# Altium project UHAL_MCP23017_LOOPBACK_Ver_B.PrjPcb
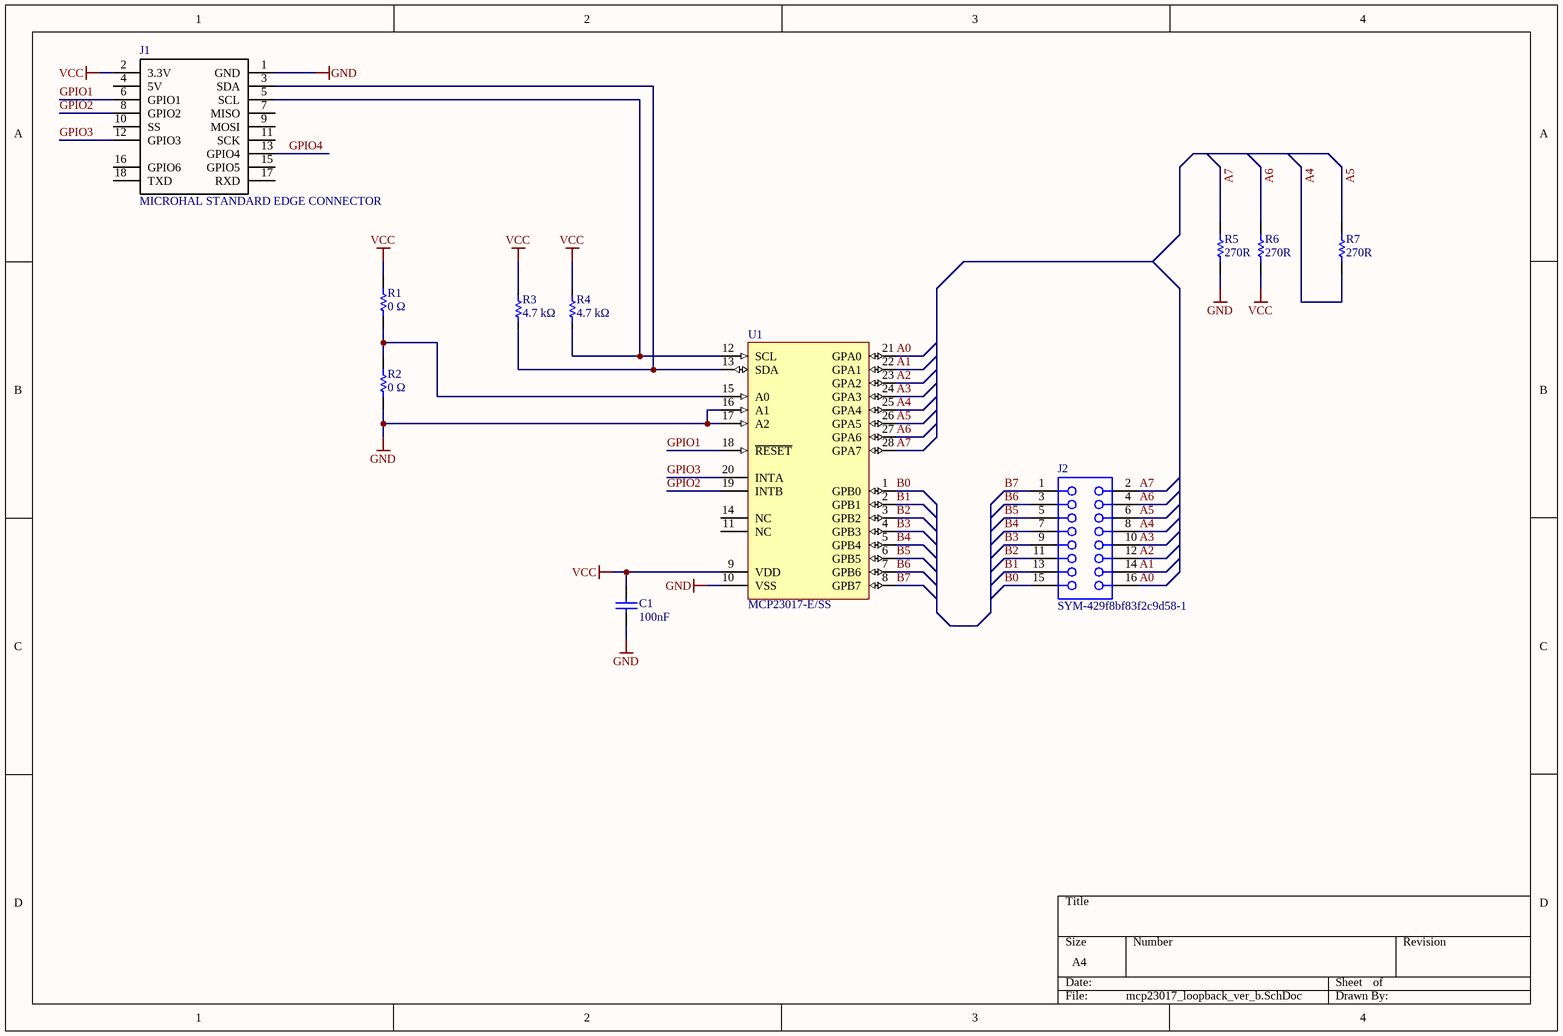
[diagram p0: mcp23017_loopback_ver_b.SchDoc]
1 sheet, 11 parts. Net scope: global (net labels, ports and power ports of the same name join across sheets).

## Sheet mcp23017_loopback_ver_b.SchDoc
size A4

### Parts
C1  Capacitance: 100nF  [CAPC1608X90X35ML10T15]  (hidden comment: Murata GCM188R71H104KA57D)
J1  MICROHAL STANDARD EDGE CONNECTOR  [PCB-n61ghpg3sznbl2uw6fwj-1]
J2  SYM-429f8bf83f2c9d58-1  [HEADER8X2]
R1  0 Ω  [RESC1608X05N]
R2  0 Ω  [RESC1608X05N]
R3  Resistance: 4.7 kΩ  [PCB-cmzy4aezi5zhn2bew7lt-1]  (hidden comment: CRCW06034K70FKEAHP)
R4  Resistance: 4.7 kΩ  [PCB-cmzy4aezi5zhn2bew7lt-1]  (hidden comment: CRCW06034K70FKEAHP)
R5  270R  [RESC1608X05N]
R6  270R  [RESC1608X05N]
R7  270R  [RESC1608X05N]
U1  MCP23017-E/SS  [SSOP-SS28_N]

### Nets
GND: C1.2 J1.1(GND) R2.1 R5.1 U1.10(VSS) U1.16(A1) U1.17(A2)
VCC: C1.1 J1.2(3.3V) R1.2 R3.1 R4.1 R6.1 U1.9(VDD)
A0: J2.16 U1.21(GPA0)
A1: J2.14 U1.22(GPA1)
A2: J2.12 U1.23(GPA2)
A3: J2.10 U1.24(GPA3)
A4: J2.8 R7.2 U1.25(GPA4)
A5: J2.6 R7.1 U1.26(GPA5)
A6: J2.4 R6.2 U1.27(GPA6)
A7: J2.2 R5.2 U1.28(GPA7)
B0: J2.15 U1.1(GPB0)
B1: J2.13 U1.2(GPB1)
B2: J2.11 U1.3(GPB2)
B3: J2.9 U1.4(GPB3)
B4: J2.7 U1.5(GPB4)
B5: J2.5 U1.6(GPB5)
B6: J2.3 U1.7(GPB6)
B7: J2.1 U1.8(GPB7)
GPIO1: J1.6(GPIO1) U1.18(~{RESET})
GPIO2: J1.8(GPIO2) U1.19(INTB)
GPIO3: J1.12(GPIO3) U1.20(INTA)
GPIO4: J1.13(GPIO4)
NetJ1_3: J1.3(SDA) R3.2 U1.13(SDA)
NetJ1_5: J1.5(SCL) R4.2 U1.12(SCL)
NetR1_1: R1.1 R2.2 U1.15(A0)

Not connected (* = marked no-connect by the designer): J1 4(5V) 7(MISO) 9(MOSI) 10(SS) 11(SCK) 15(GPIO5) 16(GPIO6) 17(RXD) 18(TXD); U1 11(NC) 14(NC)

### Library data of the parts
C1 = CMP-119667-3: CAP CER 0.1UF 50V 10% X7R 0603; Lead-Free Status: Lead Free; Voltage Rating (DC): 50.0 V; Capacitance Tolerance: ±10%; Dielectric Characteristic: X7R; Octopart Url: https://octopart.com/gcm188r71h104ka57d-murata-7894792; OctopartID: 3480fdf266eeeb47; Packaging: Cut Tape (CT); REACH SVHC Compliance: No SVHC; RoHS: Compliant
J1 = CMP-6a3uyflm72uf0am1b36s-2: microhal standard edge connector with 17 pins
J2 = CMP-429f8bf83f2c9d58-5: Conn Unshrouded Header HDR 16 POS 2.54mm Solder ST Thru-Hole Poly Bag; Number of Contacts: 16; Octopart URL: http://octopart.com/68602-116hlf-fci-7166165; Pin Pitch: 2.54 mm; Packaging: Bulk; Contact Plating: Gold
R1 R2 R5-R7 = CMP-31acf99032f6ee6b-1: RCA Series 0603 0.1 W 0 O Jumper Surface Mount Thick Film Chip Resistor; Manufacturer Part Number: RCA06030000ZSEA; Lead-Free Status: Lead Free; Power Rating: 100 mW; Case/Package (SI): 1608; RoHS: Compliant; Case/Package: 0603, 1608; OctopartID: 31acf99032f6ee6b; Packaging: Cut Tape (CT); Octopart URL: https://octopart.com/rca06030000zsea-vishay-20325948
R3 R4 = CMP-40e08b60e91c9f27-1: Surface Mount Chip Resistor, Thick Film, AEC-Q200 CRCW Series, 4.7 kohm, 250 mW, 1%, 75 V; Case/Package (SI): 1608; Voltage Rating (DC): 75.0 V; Lead-Free Status: Lead Free; Power Rating: 250 mW; Case/Package: 0603; Number of Pins: 2; REACH SVHC Compliance: No SVHC; OctopartID: 40e08b60e91c9f27; Packaging: Cut Tape (CT); Mounting Style: Surface Mount; Octopart URL: http://octopart.com/crcw06034k70fkeahp-vishay-42634394; Resistance Tolerance: ±1%; Manufacturer Part Number: CRCW06034K70FKEAHP
U1 = CMP-1159044-3: 16-Bit I/O Expander with Serial Interface, 28-Pin SSOP, Extended Temperature; Lead-Free Status: Lead Free; Number of Bits: 16; Supply Current: 0.001 A; Case/Package: SSOP; Lifecycle Status: Active; Mounting Style: Surface Mount; Number of Pins: 28; Octopart Url: https://octopart.com/mcp23017-e%2Fss-microchip-470525; OctopartID: 2f0ee6032795f0c9; Packaging: Tube; REACH SVHC Compliance: No SVHC; RoHS: Compliant